# Altium project ERM_OPTO_Long.PrjPcb
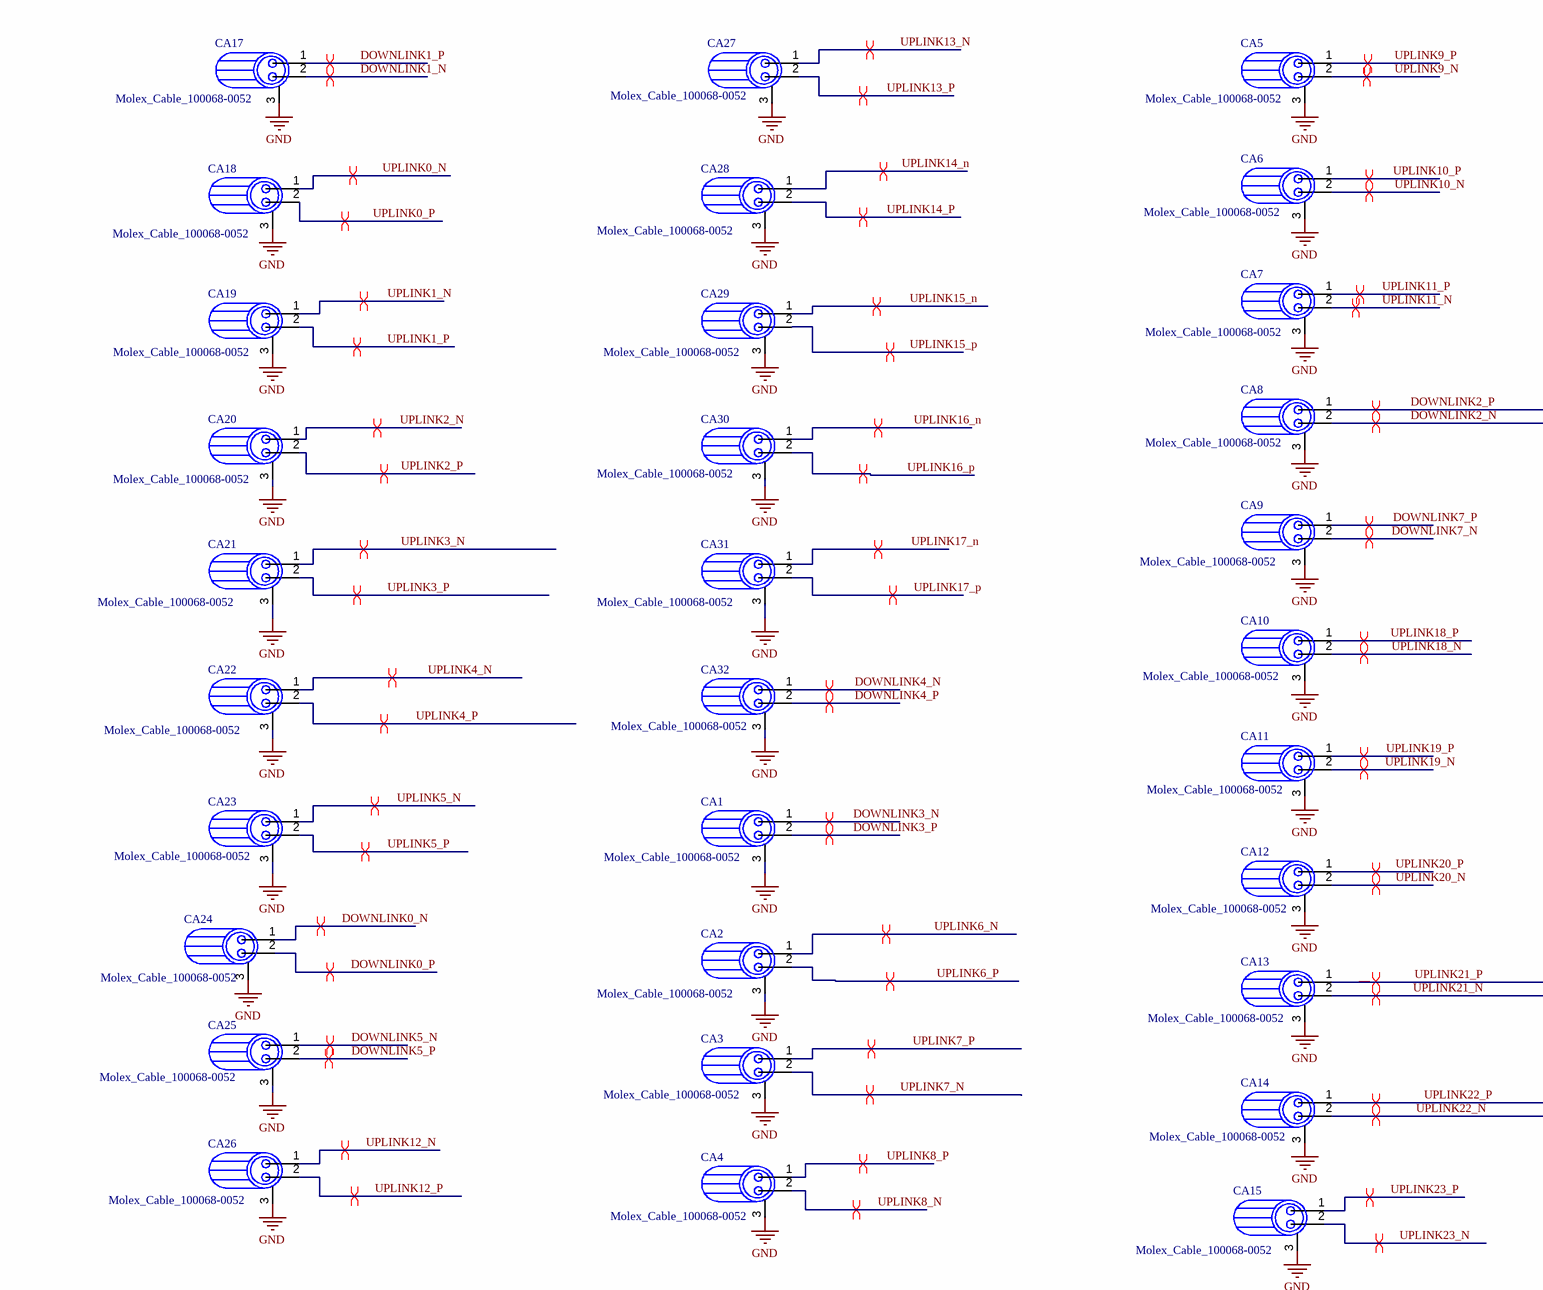
[diagram p0: ERM_OPTO_Long.SchDoc, top left]
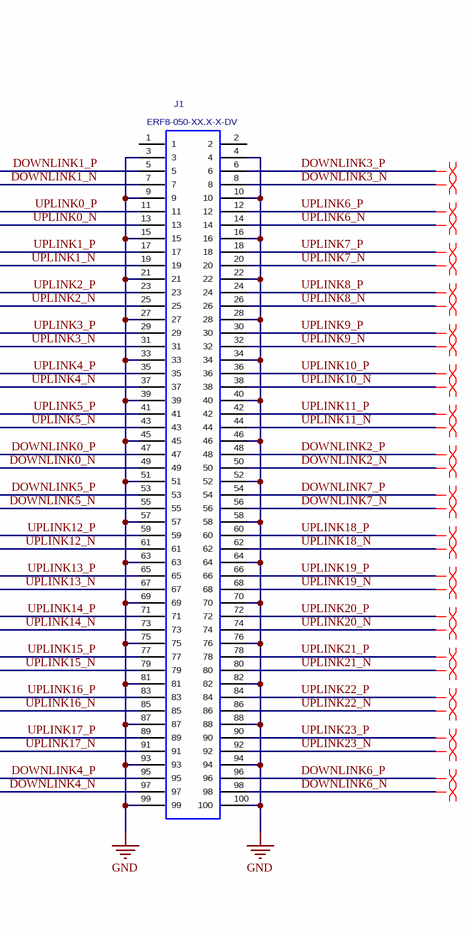
[diagram p1: ERM_OPTO_Long.SchDoc, top right]
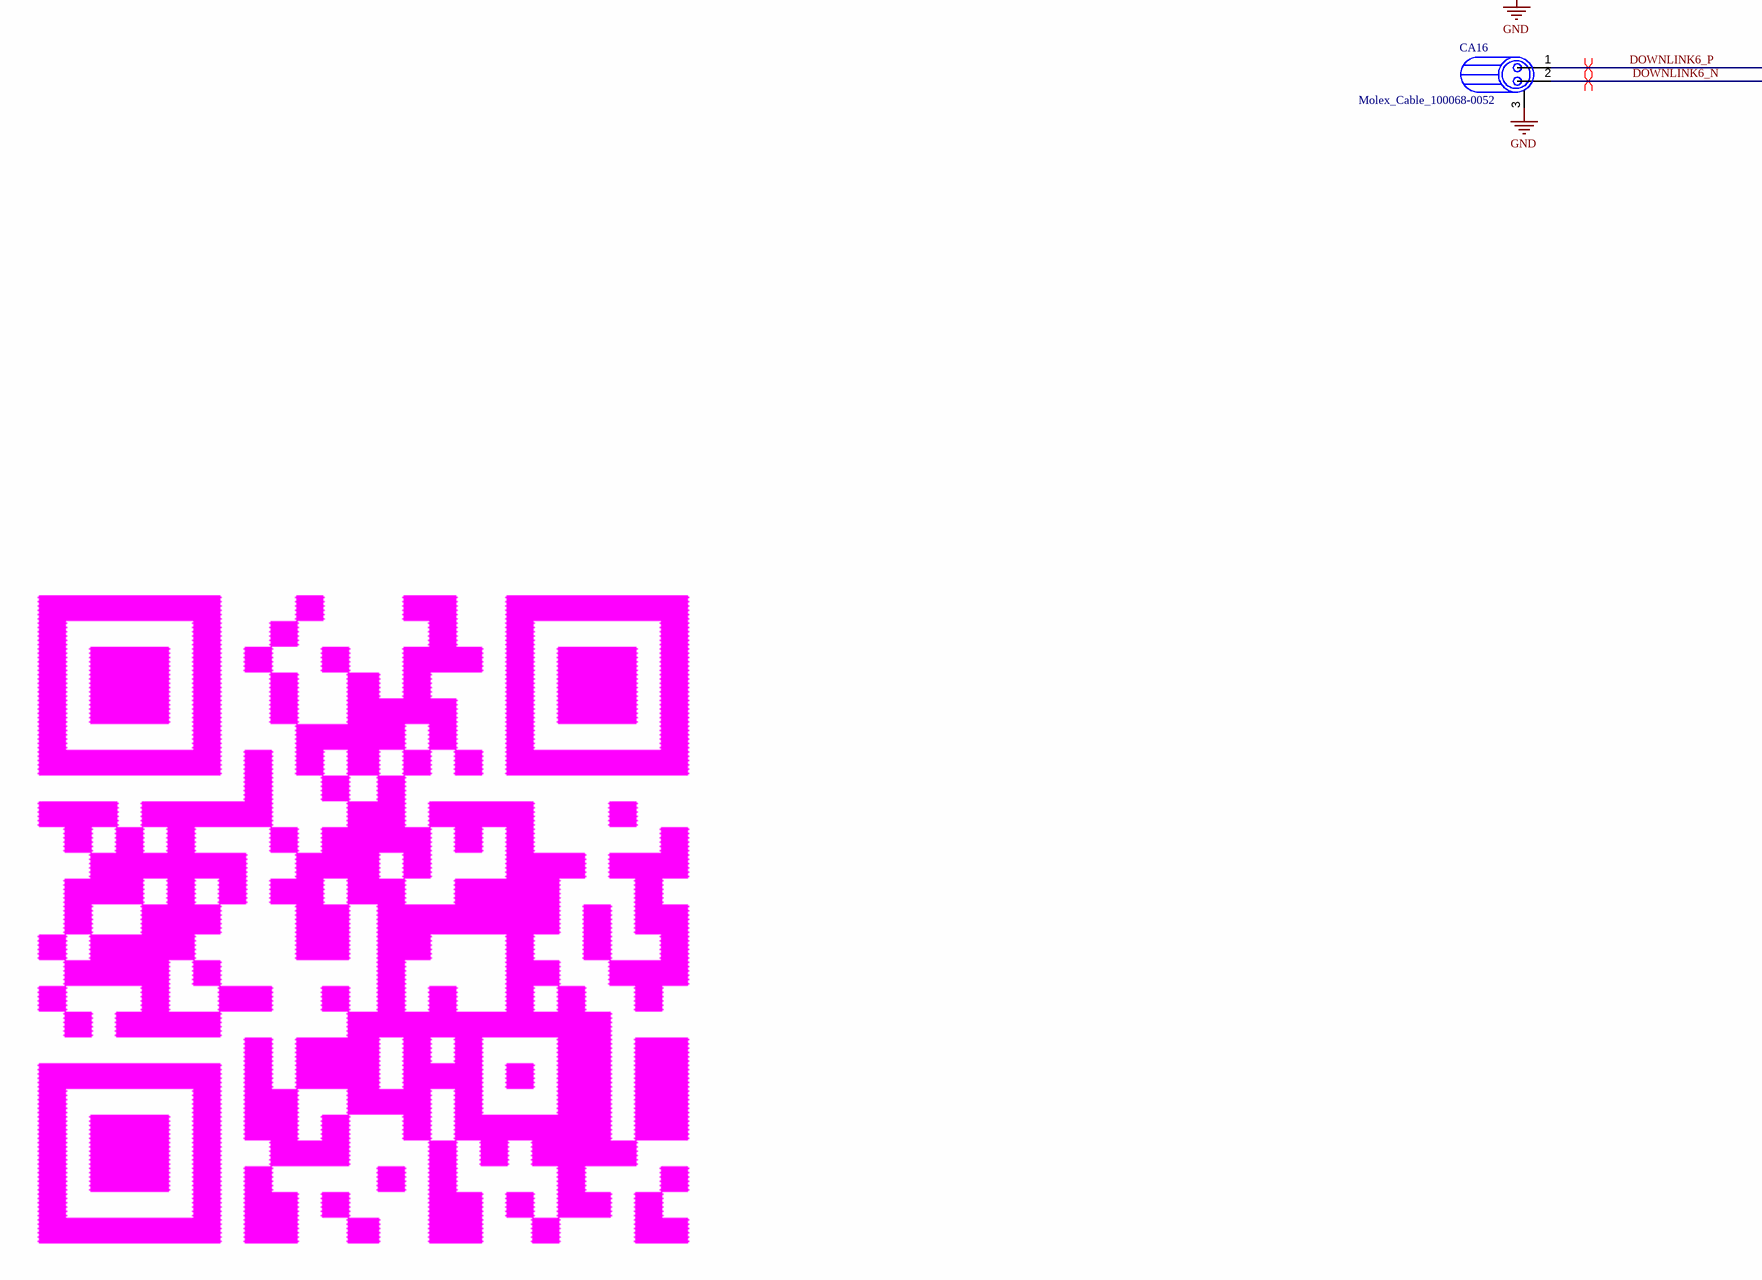
[diagram p2: ERM_OPTO_Long.SchDoc, bottom left]
Drawing_Number: 256-101-10; Drawing_Prefix: SD-; Drawing_Revision: 02; Line1_TB_Top_Level_Assembly: ATLAS; Line2_TB_Project_Name: OPTO Board; Line3_TB_Board_Name: ERM Long; PC_Number: 256-101-10; PC_Revision: 02; SD_Number: 256-101-10; SLAC_Checker: A. Young; SLAC_CHK_Date: 02-17-2022; SLAC_Drafter: A. Young; SLAC_DRFT_Date: 04-14-2020; SLAC_ENG_Date: 04-14-2020; SLAC_Engineer: A. Young; SLAC_PCB_Dsgn: A. Young/C.Yee; SLAC_PCB_DSGN_Date: 02-17-2022; Spires: ERM_OPTO_Long
1 sheet, 33 parts. Net scope: global (net labels, ports and power ports of the same name join across sheets).
Board file: ERM_OPTO_Long.PcbDoc

## Sheet ERM_OPTO_Long.SchDoc
size 863 x 558 mm; DocumentNumber: 1; SheetNumber: 1; SheetTotal: 1; PageSetup: Record=PageOptions|CenterHorizontal=True|CenterVertical=True|PrintScale=0.48|XCorrection=1.00|YCorrection=1.00|PrintKind=0|BorderSize=5000000|LeftOffset=0|BottomOffset=0|Orientation=2|PaperLength=1000|PaperWidth=1000|Scale=100|PaperSource=15|PrintQuality=-3|MediaType=1|DitherType=10|PrintScaleMode=1|PaperKind=11x17|PaperIndex=17

### Parts
CA1  Molex_Cable_100068-0052  [Molex_Cable_100068-0052_No_Via]
CA2  Molex_Cable_100068-0052  [Molex_Cable_100068-0052_No_Via]
CA3  Molex_Cable_100068-0052  [Molex_Cable_100068-0052_No_Via]
CA4  Molex_Cable_100068-0052  [Molex_Cable_100068-0052_No_Via]
CA5  Molex_Cable_100068-0052  [Molex_Cable_100068-0052_No_Via]
CA6  Molex_Cable_100068-0052  [Molex_Cable_100068-0052_No_Via]
CA7  Molex_Cable_100068-0052  [Molex_Cable_100068-0052_No_Via]
CA8  Molex_Cable_100068-0052  [Molex_Cable_100068-0052_No_Via]
CA9  Molex_Cable_100068-0052  [Molex_Cable_100068-0052_No_Via]
CA10  Molex_Cable_100068-0052  [Molex_Cable_100068-0052_No_Via]
CA11  Molex_Cable_100068-0052  [Molex_Cable_100068-0052_No_Via]
CA12  Molex_Cable_100068-0052  [Molex_Cable_100068-0052_No_Via]
CA13  Molex_Cable_100068-0052  [Molex_Cable_100068-0052_No_Via]
CA14  Molex_Cable_100068-0052  [Molex_Cable_100068-0052_No_Via]
CA15  Molex_Cable_100068-0052  [Molex_Cable_100068-0052_No_Via]
CA16  Molex_Cable_100068-0052  [Molex_Cable_100068-0052_No_Via]
CA17  Molex_Cable_100068-0052  [Molex_Cable_100068-0052_No_Via]
CA18  Molex_Cable_100068-0052  [Molex_Cable_100068-0052_No_Via]
CA19  Molex_Cable_100068-0052  [Molex_Cable_100068-0052_No_Via]
CA20  Molex_Cable_100068-0052  [Molex_Cable_100068-0052_No_Via]
CA21  Molex_Cable_100068-0052  [Molex_Cable_100068-0052_No_Via]
CA22  Molex_Cable_100068-0052  [Molex_Cable_100068-0052_No_Via]
CA23  Molex_Cable_100068-0052  [Molex_Cable_100068-0052_No_Via]
CA24  Molex_Cable_100068-0052  [Molex_Cable_100068-0052_No_Via]
CA25  Molex_Cable_100068-0052  [Molex_Cable_100068-0052_No_Via]
CA26  Molex_Cable_100068-0052  [Molex_Cable_100068-0052_No_Via]
CA27  Molex_Cable_100068-0052  [Molex_Cable_100068-0052_No_Via]
CA28  Molex_Cable_100068-0052  [Molex_Cable_100068-0052_No_Via]
CA29  Molex_Cable_100068-0052  [Molex_Cable_100068-0052_No_Via]
CA30  Molex_Cable_100068-0052  [Molex_Cable_100068-0052_No_Via]
CA31  Molex_Cable_100068-0052  [Molex_Cable_100068-0052_No_Via]
CA32  Molex_Cable_100068-0052  [Molex_Cable_100068-0052_No_Via]
J1  ERF8-050-XX.X-X-DV  [ERF8-050-XX.X-X-DV]

### Nets
GND: CA1.3 CA2.3 CA3.3 CA4.3 CA5.3 CA6.3 CA7.3 CA8.3 CA9.3 CA10.3 CA11.3 CA12.3 CA13.3 CA14.3 CA15.3 CA16.3 CA17.3 CA18.3 CA19.3 CA20.3 CA21.3 CA22.3 CA23.3 CA24.3 CA25.3 CA26.3 CA27.3 CA28.3 CA29.3 CA30.3 CA31.3 CA32.3 J1.3 J1.4 J1.9 J1.10 J1.15 J1.16 J1.21 J1.22 J1.27 J1.28 J1.33 J1.34 J1.39 J1.40 J1.45 J1.46 J1.51 J1.52 J1.57 J1.58 J1.63 J1.64 J1.69 J1.70 J1.75 J1.76 J1.81 J1.82 J1.87 J1.88 J1.93 J1.94 J1.99 J1.100
DOWNLINK0_N: CA24.1 J1.49
DOWNLINK0_P: CA24.2 J1.47
DOWNLINK1_N: CA17.2 J1.7
DOWNLINK1_P: CA17.1 J1.5
DOWNLINK2_N: CA8.2 J1.50
DOWNLINK2_P: CA8.1 J1.48
DOWNLINK3_N: CA1.1 J1.8
DOWNLINK3_P: CA1.2 J1.6
DOWNLINK4_N: CA32.1 J1.97
DOWNLINK4_P: CA32.2 J1.95
DOWNLINK5_N: CA25.1 J1.55
DOWNLINK5_P: CA25.2 J1.53
DOWNLINK6_N: CA16.2 J1.98
DOWNLINK6_P: CA16.1 J1.96
DOWNLINK7_N: CA9.2 J1.56
DOWNLINK7_P: CA9.1 J1.54
UPLINK0_N: CA18.1 J1.13
UPLINK0_P: CA18.2 J1.11
UPLINK1_N: CA19.1 J1.19
UPLINK1_P: CA19.2 J1.17
UPLINK2_N: CA20.1 J1.25
UPLINK2_P: CA20.2 J1.23
UPLINK3_N: CA21.1 J1.31
UPLINK3_P: CA21.2 J1.29
UPLINK4_N: CA22.1 J1.37
UPLINK4_P: CA22.2 J1.35
UPLINK5_N: CA23.1 J1.43
UPLINK5_P: CA23.2 J1.41
UPLINK6_N: CA2.1 J1.14
UPLINK6_P: CA2.2 J1.12
UPLINK7_N: CA3.2 J1.20
UPLINK7_P: CA3.1 J1.18
UPLINK8_N: CA4.2 J1.26
UPLINK8_P: CA4.1 J1.24
UPLINK9_N: CA5.2 J1.32
UPLINK9_P: CA5.1 J1.30
UPLINK10_N: CA6.2 J1.38
UPLINK10_P: CA6.1 J1.36
UPLINK11_N: CA7.2 J1.44
UPLINK11_P: CA7.1 J1.42
UPLINK12_N: CA26.1 J1.61
UPLINK12_P: CA26.2 J1.59
UPLINK13_N: CA27.1 J1.67
UPLINK13_P: CA27.2 J1.65
UPLINK14_N: CA28.1 J1.73
UPLINK14_P: CA28.2 J1.71
UPLINK15_N: CA29.1 J1.79
UPLINK15_P: CA29.2 J1.77
UPLINK16_N: CA30.1 J1.85
UPLINK16_P: CA30.2 J1.83
UPLINK17_N: CA31.1 J1.91
UPLINK17_P: CA31.2 J1.89
UPLINK18_N: CA10.2 J1.62
UPLINK18_P: CA10.1 J1.60
UPLINK19_N: CA11.2 J1.68
UPLINK19_P: CA11.1 J1.66
UPLINK20_N: CA12.2 J1.74
UPLINK20_P: CA12.1 J1.72
UPLINK21_N: CA13.2 J1.80
UPLINK21_P: CA13.1 J1.78
UPLINK22_N: CA14.2 J1.86
UPLINK22_P: CA14.1 J1.84
UPLINK23_N: CA15.2 J1.92
UPLINK23_P: CA15.1 J1.90

Not connected (* = marked no-connect by the designer): J1 1 2

### Layout directives
differential pair: (no net found under the mark), DOWNLINK0_N, DOWNLINK0_P, DOWNLINK1_N, DOWNLINK1_P, DOWNLINK2_N, DOWNLINK2_P, DOWNLINK3_N, DOWNLINK3_P, DOWNLINK4_N, DOWNLINK4_P, DOWNLINK5_N, DOWNLINK5_P, DOWNLINK6_N, DOWNLINK6_P, DOWNLINK7_N, DOWNLINK7_P, UPLINK0_N, UPLINK0_P, UPLINK1_N, UPLINK1_P, UPLINK2_N, UPLINK2_P, UPLINK3_N, UPLINK3_P, UPLINK4_N, UPLINK4_P, UPLINK5_N, UPLINK5_P, UPLINK6_N, UPLINK6_P, UPLINK7_N, UPLINK7_P, UPLINK8_N, UPLINK8_P, UPLINK9_N, UPLINK9_P, UPLINK10_N, UPLINK10_P, UPLINK11_N, UPLINK11_P, UPLINK12_N, UPLINK12_P, UPLINK13_N, UPLINK13_P, UPLINK14_N, UPLINK14_P, UPLINK15_N, UPLINK15_P, UPLINK16_N, UPLINK16_P, UPLINK17_N, UPLINK17_P, UPLINK18_N, UPLINK18_P, UPLINK19_N, UPLINK19_P, UPLINK20_N, UPLINK20_P, UPLINK21_N, UPLINK21_P, UPLINK22_N, UPLINK22_P, UPLINK23_N, UPLINK23_P

### Notes on the sheet
- ENGR
- REV
- DESCRIPTION
- DRFT
- CHKR
- APPV
- DATE
- CAD FILE:
- SHEET     OF
- NOT BE COPIED, PUBLISHED OR OTHERWISE FURTHER DISSEMINATED WITHOUT
- THE DRAWINGS, SPECIFICATIONS AND OTHER DATA HEREIN PROVIDED SHALL
- PRIOR WRITTEN PERMISSION OF STANFORD UNIVERSITY / SLAC.
- ENGR:
- APPROVALS
- REVISION
- PRIOR WRITTEN PERMISSION OF STANFORD UNIVERSITY/SLAC
- DRFT:
- CHKR:
- D
- SLAC Release

### Library data of the parts
CA1-CA32 = Molex_Cable_100068-0052_No_Via: Molex; 100068-0052, Twinax Cable 34AWG 100 Ohms; Unit_Price_Static: 25.00; Package / Case: Molex_100068-0052; Manufacturer: Molex; Manufacturer Part Number: 100068-0052
J1 = ERF8-050-XX.X-X-DV: Socket Assembly, Double Row Vertical, Surface Mount, 0.8mm Pitch, 100 Pins; MANUFACTURER: SAMTEC; Manufacturer Part Number: ERF8-050-05.0-S-DV; Unit_Price_Static: 7.00; CREATED: October 23, 2014 - Wendy Xin; PCB DECAL: ERF8-050-XX.X-X-DV; Package / Case: ERF8-050-05.0-S-DV